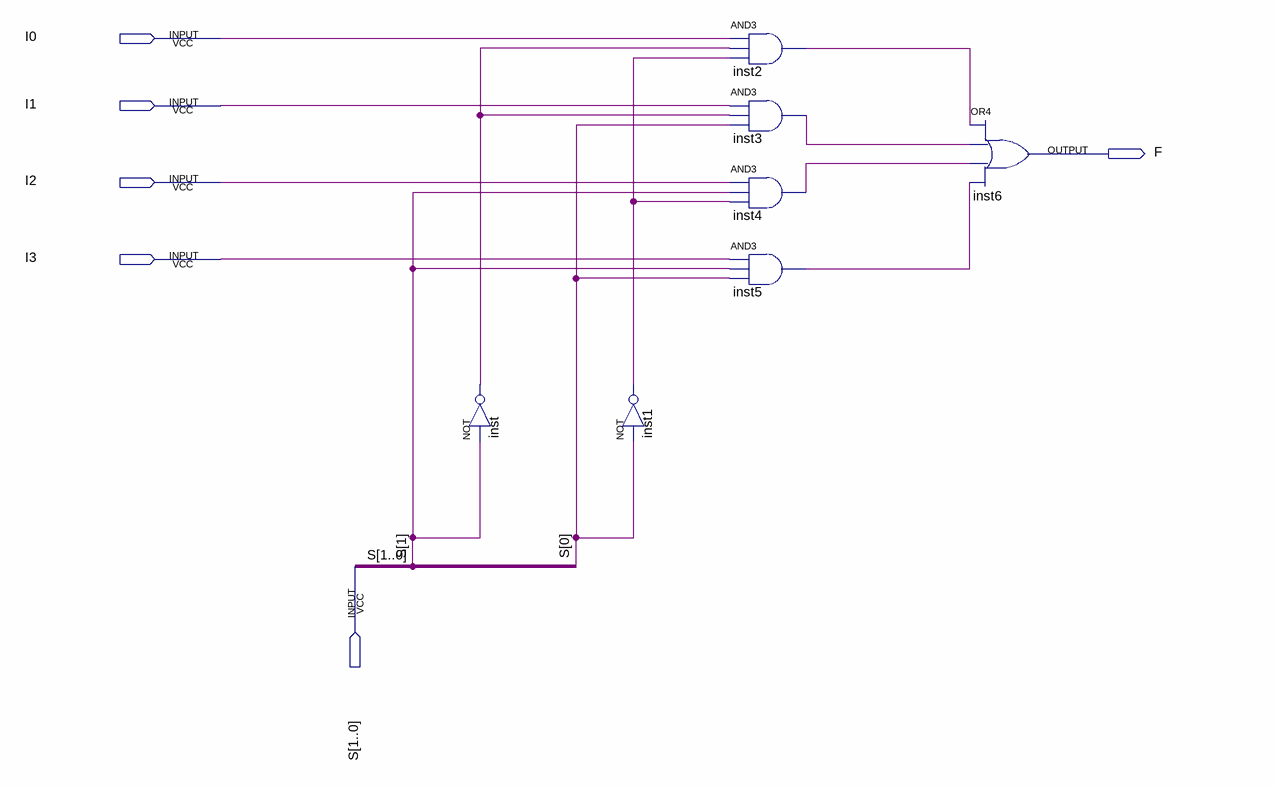
[diagram p0: schematic sheet]
// Quartus schematic 4to1Mux.bdf as structural Verilog: 7 symbols, 6 pins
module \4to1Mux  (
  input  I0,
  input  I1,
  input  I2,
  input  I3,
  input  [1:0] S,
  output F
);

  wire inst1_out, inst2_out, inst3_out, inst4_out, inst5_out, inst_out;

  not inst (inst_out, S[1]);
  not inst1 (inst1_out, S[0]);
  and inst2 (inst2_out, I0, inst_out, inst1_out);
  and inst3 (inst3_out, I1, inst_out, S[0]);
  and inst4 (inst4_out, I2, S[1], inst1_out);
  and inst5 (inst5_out, I3, S[1], S[0]);
  or inst6 (F, inst2_out, inst3_out, inst4_out, inst5_out);
endmodule
